# EAGLE design ad597_breakout_v1 (EAGLE 6.4)
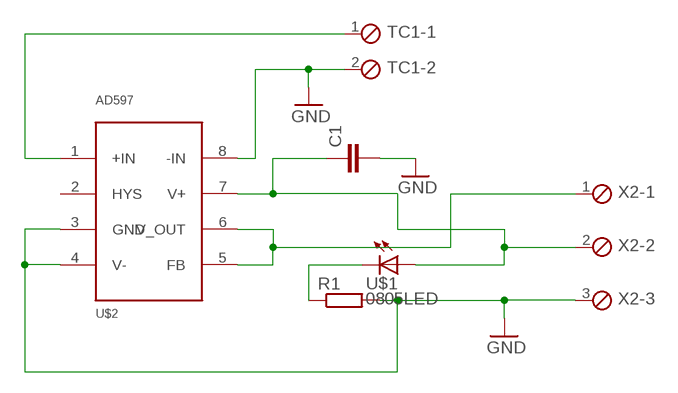
[diagram p0: schematic, sheet 1]

## Parts
C1  C-EUC0805  [C0805]
R1  R-EU_R0805  [R0805]
TC1  MPT2  [2POL254]
U$1  0805LED  [0805LED]
U$2  AD597  [SOP8]
X2  MPT3  [3POL254]

## Nets
GND: C1.2 R1.2 TC1.2 U$2.3(GND) U$2.4(V-) U$2.8(-IN) X2.3
N$1: TC1.1 U$2.1(+IN)
N$3: R1.1 U$1.C
N$4: U$2.5(FB) U$2.6(V_OUT) X2.1
VCC: C1.1 U$1.A U$2.7(V+) X2.2
Unconnected: U$2.2(HYS)

## Library data of the parts
C1 = rcl_mod:C-EU: CAPACITOR, European symbol
R1 = rcl_mod:R-EU_: RESISTOR, European symbol
TC1 = ultimaker-phoenix-mpt3-254:MPT2: PHOENIX CONNECTOR
U$1 = chipled:0805LED
U$2 = ad597:AD597
X2 = ultimaker-phoenix-mpt3-254:MPT3: PHOENIX CONNECTOR

## Board
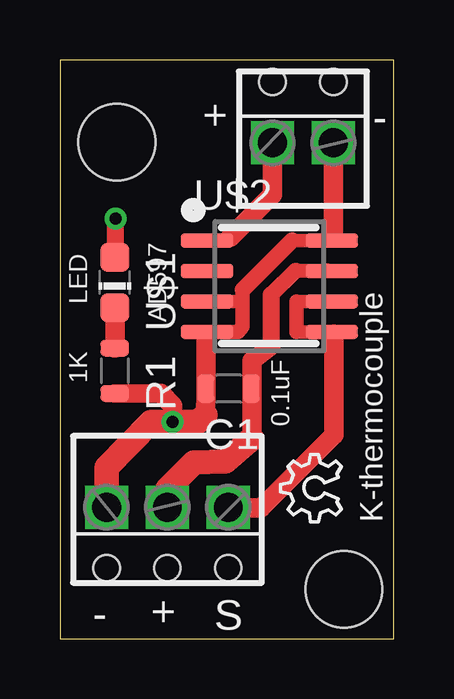
[diagram p1: board, top side]
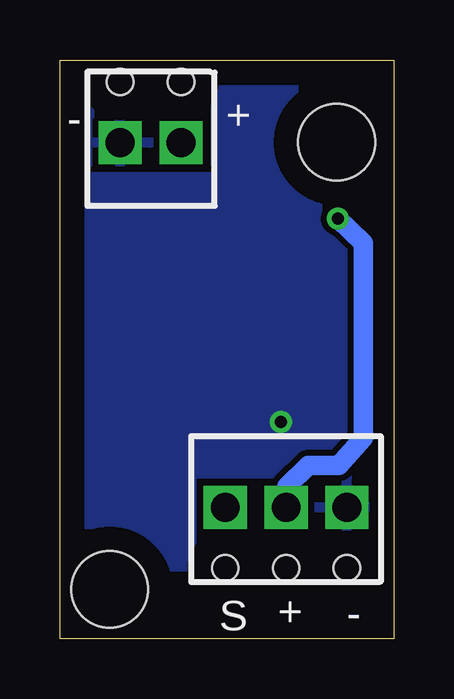
[diagram p2: board, bottom side, seen from below]

Size 13.92 x 24.14 mm. Coordinates in mm from the lower left corner, seen from the top.
Outline: 0,0 13.92,0 13.92,24.14 0,24.14 0,0
Copper layers (1*16): Top 0.035mm / dielectric 1.5mm / Bottom 0.035mm
Design rules "default": minimum track width 10mil, minimum drill 24mil, track to track 10mil, track to pad 10mil, pad to pad 10mil, via to via 10mil, smd to smd 10mil, copper to edge 40mil, drill to drill 8mil, minimum pad ring 10mil, minimum via ring 8mil, stop-mask expansion 4mil, vias tented up to drill 0mil, thermal gap 10mil
Holes 3.2 mm at 2.37,20.71 11.84,2.07
bRestrict: area 8.3,2.4 to 9.8,2.8; area 5,6.5 to 8.2,6.7; area 8.1,3.9 to 8.2,6.6; area 7.6,19.5 to 7.9,22.1; area 7.6,19.5 to 13,19.7

### Footprints (pad centres in the part's own frame; a part is rotated, then mirrored left to right if it is on the bottom)
C0805 = smd 0.7 x 1.2: 1 -0.95,0; 2 0.95,0
R0805 = smd 0.7 x 1.2: 1 -0.95,0; 2 0.95,0
2POL254 = drill 1.2 square: 1 -1.27,0; 2 1.27,0 | hole 1.1: 1.27,2.54; -1.27,2.54
0805LED = smd 1.2 x 1.2: A 0,-1.05; C 0,1.05
SOP8 = smd 0.6 x 2.2: 1 -1.905,-2.6; 2 -0.635,-2.6; 3 0.635,-2.6; 4 1.905,-2.6; 5 1.905,2.6; 6 0.635,2.6; 7 -0.635,2.6; 8 -1.905,2.6
3POL254 = drill 1.2 square: 1 -2.54,0; 2 0,0; 3 2.54,0 | hole 1.1: -2.54,2.54; 0,2.54; 2.54,2.54

### Placement (x,y rotation side)
C1  7.04,10.44 180 top
LOGO1  OSHW_LOGO_6MILX0100-NT  [OSHW_6X100_NOTEXT]  11.75,4.88 90 top
R1  2.29,11.18 270 top
TC1  10.13,20.69 0 top
U$1  2.29,14.86 180 top
U$2  8.74,14.71 270 top
X2  4.48,5.49 180 top

### Tracks (layer width: path | path; a pad name or v marks a point on that pad's centre or on a via)
GND  (via drill 0.5)
  Top 0.254: 11.2,16.61 11.3,16.64 U$2.8 11.05,16.64 11.4,16.77 | 7.62,13.84 7.54,14.07 | 6.1,10.41 C1.2 6.1,10.36 | U$2.4 6.1,12.83 6.1,12.6 | 6.1,12.95 U$2.4 | 7.06,12.8 6.78,12.78 6.48,12.78 U$2.4
  Top 0.559: U$2.3 7.54,14.07 | 9.68,16.61 11.2,16.61
  Top 0.61: 7.06,12.8 7.42,12.8 7.62,13.03 7.62,13.84 7.62,14.55
  Top 0.66: 7.62,14.55 9.68,16.61
  Top 0.762: R1.2 4.23,10.23
  Top 0.813: TC1.2 11.4,16.77 | 6.07,9.35 6.1,10.36 6.1,10.41 6.1,12.6 | 4.23,10.23 4.7,9.73 v4.7,9.04
  Top 1.016: X2.3 1.94,7.15 3.81,9.04 v4.7,9.04 5.79,9.07 6.07,9.35
  pour Bottom: -0.76,24.64 14.48,24.64 14.48,-0.51 -0.76,-0.51 -0.76,24.38
N$1
  Top 0.254: 7.11,16.76 6.73,16.64 6.1,16.64 U$2.1
  Top 0.813: TC1.1 8.86,18.52 7.11,16.76
N$3
  Top 0.254: U$1.C 2.29,13.72 2.31,13.56
  Top 0.813: R1.1 2.31,12.13 2.31,13.56
N$4
  Top 0.254: U$2.5 11.3,12.83 11.43,12.45
  Top 0.559: 9.86,12.8 U$2.5 | 9.86,14.07 U$2.6
  Top 0.61: 11.42,12.81 11.43,12.57 | 7.05,5.46 X2.1 | 9.86,14.07 9.86,12.8
  Top 0.762: 11.43,12.57 11.43,12.45
  Top 0.813: 7.05,5.46 8.38,5.46 11.43,8.51 11.43,12.45
VCC  (via drill 0.5)
  Top 0.254: U$1.A 2.29,15.75 2.32,15.91 | U$2.7 11.3,15.37 11.18,15.37 | 8,10.41 C1.1
  Top 0.61: 9.83,15.34 11.18,15.37
  Top 0.66: 8.81,14.35 9.83,15.34
  Top 0.711: 2.32,15.91 v2.32,17.53 | 8.81,12.22 8.81,14.35
  Top 0.762: 8,11.58 8.81,12.22
  Top 0.813: 8,8.36 8,10.41 8,11.58
  Top 1.016: X2.2 4.48,6.26 5.59,7.37 6.91,7.39 8,8.36
  Bottom 0.254: X2.2 4.57,5.46 4.45,5.59
  Bottom 0.813: 4.45,5.59 4.45,6.35 3.56,7.24 2.29,7.24 1.27,8.38 1.27,16.51 v2.32,17.53

### Text on the board
tPlace: + | - | LED | AD597 | 1K | 0.1uF | K-thermocouple | + | - | S
bPlace: + | - | + | - | S
bStop: bitfab | 2013